# Altium schematic sheet Indication_and_Notification.SchDoc
size A4
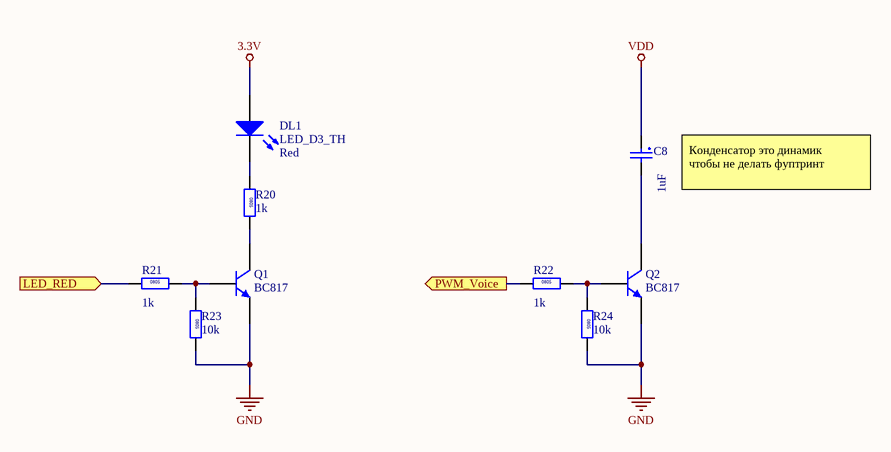
[diagram p0: Indication_and_Notification.SchDoc]

## Parts
C8  value 1uF  [ECAP1325]  (hidden comment: ECAP-1325)
DL1  LED_D3_TH  value Red  [LED_D3_TH]
Q1  BC817  [SOT23-3M]
Q2  BC817  [SOT23-3M]
R20  value 1k  [RESC2012-0805M]  (hidden comment: RESC_0805_R)
R21  value 1k  [RESC2012-0805M]  (hidden comment: RESC_0805_R)
R22  value 1k  [RESC2012-0805M]  (hidden comment: RESC_0805_R)
R23  value 10k  [RESC2012-0805M]  (hidden comment: RESC_0805_R)
R24  value 10k  [RESC2012-0805M]  (hidden comment: RESC_0805_R)

## Ports
LED_RED (in), PWM_Voice (out)

## Nets
3.3V: DL1.1(A)
GND: Q1.2(E) Q2.2(E) R23.2 R24.2
VDD: C8.1
LED_RED: R21.1 ; port LED_RED
PWM_Voice: R22.1 ; port PWM_Voice
NetC8_2: C8.2 Q2.3(C)
NetDL1_2: DL1.2(K) R20.1
NetQ1_1: Q1.1(B) R21.2 R23.1
NetQ1_3: Q1.3(C) R20.2
NetQ2_1: Q2.1(B) R22.2 R24.1

## Notes on the sheet
- (near C8) Конденсатор это динамик
  чтобы не делать фуптринт
- (in symbol RESC_0805_R) 0805

## Library data of the parts
C8 = ECAP-1325: Capacitor electrolytic 5 mm pitch, 13*25 body
DL1 = LED_D3_TH: LED Through hole D3mm
Q1 Q2 = BC817: BC817 NPN Transistor
R20-R24 = RESC_0805_R: Resistor 0805